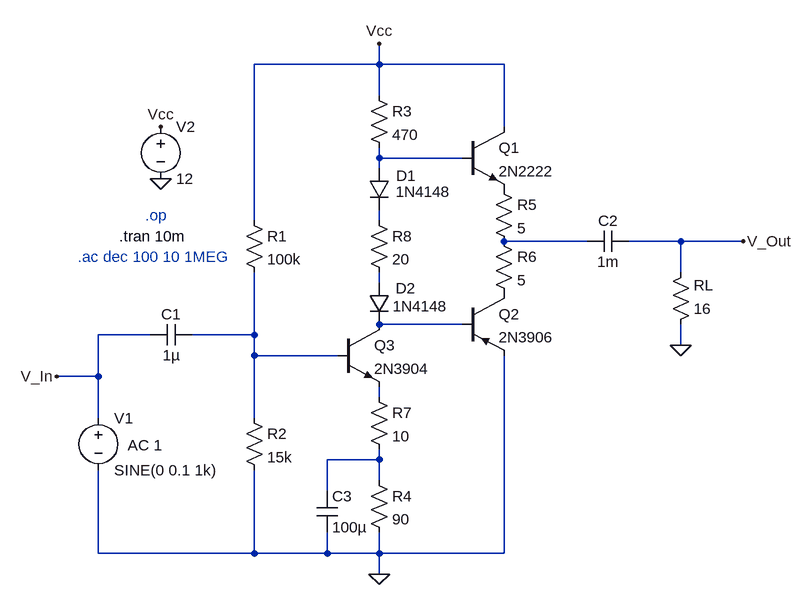
[diagram p0: schematic Class_AB_Amplifier.asc]
Class_AB_Amplifier.asc, the LTspice schematic file:
Version 4.1
SHEET 1 880 708
WIRE 48 -96 48 -128
WIRE 48 -96 -144 -96
WIRE 240 -96 48 -96
WIRE 48 -48 48 -96
WIRE 240 0 240 -96
WIRE 48 48 48 32
WIRE 176 48 48 48
WIRE 48 64 48 48
WIRE -144 144 -144 -96
WIRE 48 144 48 128
WIRE 368 176 240 176
WIRE 512 176 432 176
WIRE 608 176 512 176
WIRE 512 224 512 176
WIRE 48 240 48 224
WIRE 176 304 48 304
WIRE -304 320 -384 320
WIRE -144 320 -144 224
WIRE -144 320 -240 320
WIRE 512 336 512 304
WIRE -144 352 -144 320
WIRE -16 352 -144 352
WIRE -384 384 -384 320
WIRE -384 384 -448 384
WIRE 48 416 48 400
WIRE -384 448 -384 384
WIRE -144 448 -144 352
WIRE 48 512 48 496
WIRE 48 512 -32 512
WIRE 48 544 48 512
WIRE -32 560 -32 512
WIRE -384 656 -384 528
WIRE -144 656 -144 528
WIRE -144 656 -384 656
WIRE -32 656 -32 624
WIRE -32 656 -144 656
WIRE 48 656 48 624
WIRE 48 656 -32 656
WIRE 240 656 240 352
WIRE 240 656 48 656
WIRE 48 688 48 656
FLAG 48 688 0
FLAG -288 0 Vcc
FLAG -288 80 0
FLAG 48 -128 Vcc
FLAG 608 176 V_Out
FLAG 512 336 0
FLAG -448 384 V_In
SYMBOL npn 176 0 R0
SYMATTR InstName Q1
SYMATTR Value 2N2222
SYMBOL diode 32 64 R0
WINDOW 0 42 11 Left 2
WINDOW 3 41 36 Left 2
SYMATTR InstName D1
SYMATTR Value 1N4148
SYMBOL diode 32 240 R0
WINDOW 0 41 8 Left 2
WINDOW 3 37 36 Left 2
SYMATTR InstName D2
SYMATTR Value 1N4148
SYMBOL cap -240 304 R90
WINDOW 0 0 32 VBottom 2
WINDOW 3 32 32 VTop 2
SYMATTR InstName C1
SYMATTR Value 1µ
SYMBOL res 32 -64 R0
SYMATTR InstName R3
SYMATTR Value 470
SYMBOL res 496 320 M180
WINDOW 0 36 76 Left 2
WINDOW 3 36 40 Left 2
SYMATTR InstName RL
SYMATTR Value 16
SYMBOL voltage -384 432 R0
WINDOW 123 45 58 Left 2
WINDOW 39 0 0 Left 0
SYMATTR Value2 AC 1
SYMATTR InstName V1
SYMATTR Value SINE(0 0.1 1k)
SYMBOL voltage -288 -16 R0
WINDOW 123 0 0 Left 0
WINDOW 39 0 0 Left 0
SYMATTR InstName V2
SYMATTR Value 12
SYMBOL cap 432 160 R90
WINDOW 0 0 32 VBottom 2
WINDOW 3 32 32 VTop 2
SYMATTR InstName C2
SYMATTR Value 1m
SYMBOL npn -16 304 R0
SYMATTR InstName Q3
SYMATTR Value 2N3904
SYMBOL res -160 432 R0
SYMATTR InstName R2
SYMATTR Value 15k
SYMBOL res 32 528 R0
SYMATTR InstName R4
SYMATTR Value 90
SYMBOL res -160 128 R0
SYMATTR InstName R1
SYMATTR Value 100k
SYMBOL cap -48 560 R0
SYMATTR InstName C3
SYMATTR Value 100µ
SYMBOL pnp 176 256 R0
SYMATTR InstName Q2
SYMATTR Value 2N3906
SYMBOL res 224 80 R0
SYMATTR InstName R5
SYMATTR Value 5
SYMBOL res 224 160 R0
SYMATTR InstName R6
SYMATTR Value 5
SYMBOL res 32 400 R0
SYMATTR InstName R7
SYMATTR Value 10
SYMBOL res 32 128 R0
SYMATTR InstName R8
SYMATTR Value 20
TEXT -352 168 Left 2 !.tran 10m
TEXT -416 200 Left 2 ;.ac dec 100 10 1MEG
TEXT -312 136 Left 2 ;.op

The netlist it stands for:
* Class_AB_Amplifier.asc
Q1 Vcc N001 P001 0 2N2222
D1 N001 N002 1N4148
D2 N004 N005 1N4148
C1 N006 V_In 1µ
R3 Vcc N001 470
RL 0 V_Out 16
V1 V_In 0 SINE(0 0.1 1k) AC 1
V2 Vcc 0 12
C2 V_Out N003 1m
Q3 N005 N006 N007 0 2N3904
R2 N006 0 15k
R4 N008 0 90
R1 Vcc N006 100k
C3 N008 0 100µ
Q2 P002 N005 0 0 2N3906
R5 P001 N003 5
R6 N003 P002 5
R7 N007 N008 10
R8 N002 N004 20
.model D D
.lib standard.dio
.model NPN NPN
.model PNP PNP
.lib standard.bjt
.tran 10m
* .ac dec 100 10 1MEG
* .op
.backanno
.end